# EAGLE design Adafruit Feather M0 Express dev (EAGLE 8.0.1)
COMPANY: ADAFRUIT INDUSTRIES; DRAWN: KTOWN; REV: B
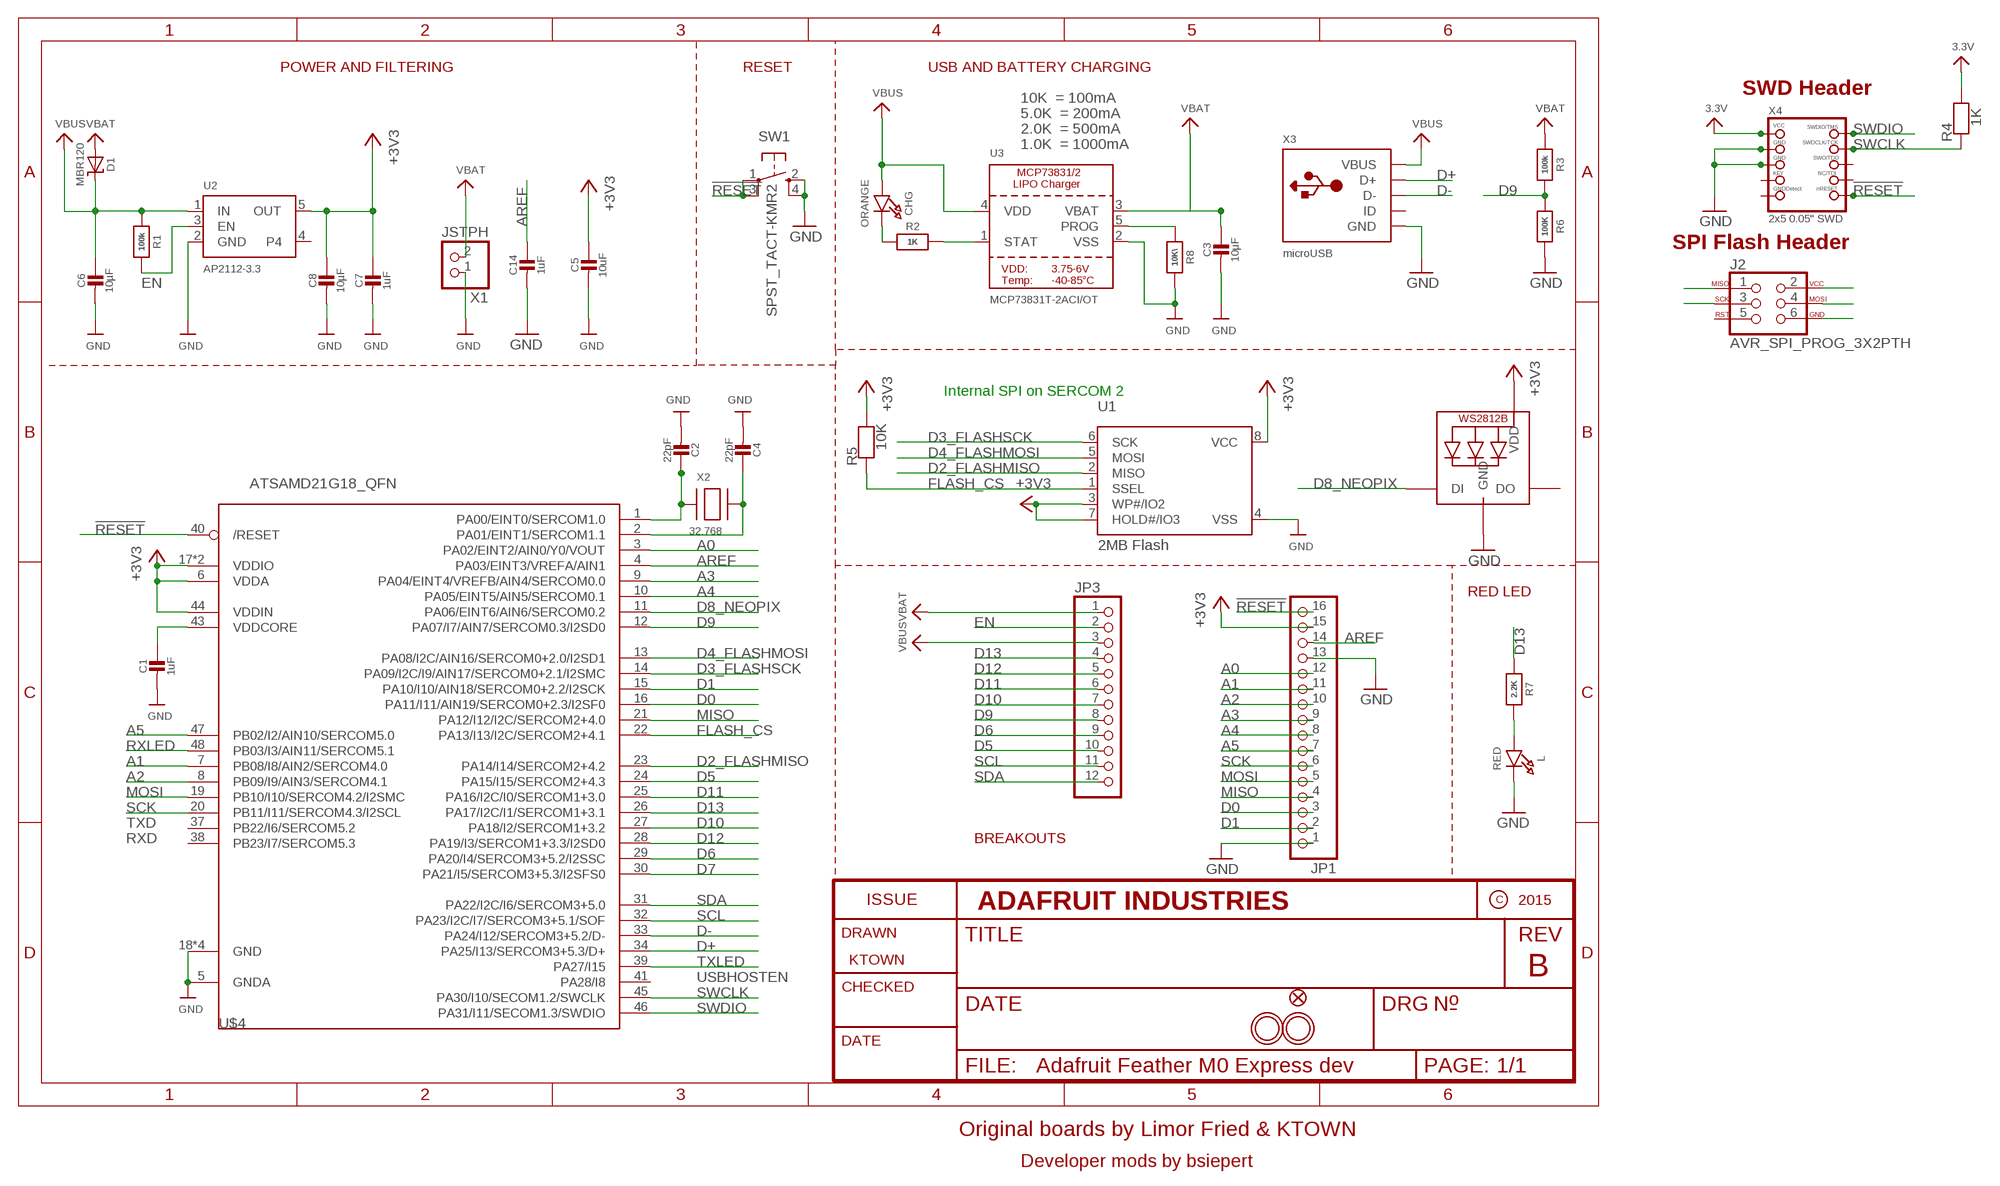
[diagram p0: schematic, sheet 1]

## Parts
C1  1uF  CAP_CERAMIC0603_NO  [0603-NO]
C2  22pF  CAP_CERAMIC0603_NO  [0603-NO]
C3  10µF  CAP_CERAMIC0805-NOOUTLINE  [0805-NO]
C4  22pF  CAP_CERAMIC0603_NO  [0603-NO]
C5  10uF  CAP_CERAMIC0805-NOOUTLINE  [0805-NO]
C6  10µF  CAP_CERAMIC0805-NOOUTLINE  [0805-NO]
C7  1uF  CAP_CERAMIC0603_NO  [0603-NO]
C8  10µF  CAP_CERAMIC0805-NOOUTLINE  [0805-NO]
C14  1uF  CAP_CERAMIC0603_NO  [0603-NO]
CHG  ORANGE  LED0805_NOOUTLINE  [CHIPLED_0805_NOOUTLINE]
D1  MBR120  DIODE-SCHOTTKYSOD-123  [SOD-123]
J2  AVR_SPI_PROG_3X2PTH  [2X3]
JP1  HEADER-1X16ROUND  [1X16_ROUND]
JP3  HEADER-1X12  [1X12_ROUND]
L  RED  LED0805_NOOUTLINE  [CHIPLED_0805_NOOUTLINE]
LED1  WS2812B3535  [LED3535]
R1  100k  RESISTOR_0603_NOOUT  [0603-NO]
R2  1K  RESISTOR_0603_NOOUT  [0603-NO]
R3  100k  RESISTOR_0603_NOOUT  [0603-NO]
R4  1K  RESISTOR0805_NOOUTLINE  [0805-NO]
R5  10K  RESISTOR_0603_NOOUT  [0603-NO]
R6  100K  RESISTOR_0603_NOOUT  [0603-NO]
R7  2.2K  RESISTOR_0603_NOOUT  [0603-NO]
R8  10K\  RESISTOR_0603_NOOUT  [0603-NO]
SW1  SPST_TACT-KMR2  [KMR2]
U1  2MB Flash  SPIFLASH_SOIC8208MIL  [SOIC8_208MIL]
U2  AP2112-3.3  VREG_SOT23-5  [SOT23-5]
U3  MCP73831T-2ACI/OT  MCP73831/2  [SOT23-5]
U$4  ATSAMD21G18_QFN  ATSAMD21G_QFN  [TQFN48_7MM]
U$31  MOUNTINGHOLE2.5  [MOUNTINGHOLE_2.5_PLATED]
U$32  MOUNTINGHOLE2.5  [MOUNTINGHOLE_2.5_PLATED]
U$34  FIDUCIAL""  [FIDUCIAL_1MM]
X1  JSTPH  CON_JST_PH_2PIN  [JSTPH2]
X2  32.768  XTAL-3.2X1.5  [XTAL3215]
X3  microUSB  USB_MICRO_20329_V2  [4UCONN_20329_V2]
X4  2x5 0.05" SWD  JTAG-CORTEXBOXPOSTS  [2X05_1.27MM_BOX_POSTS]

## Nets
!RESET: JP1.16 SW1.1(P) SW1.3(P1) U$4.40(/RESET) X4.10(NRESET)
+3V3: C5.1 C7.1 C8.1 J2.2 JP1.15 LED1.2(VDD) R4.2 R5.2 U1.3(WP#/IO2) U1.7(HOLD#/IO3) U1.8(VCC) U2.5(OUT) U$4.6(VDDA) U$4.17(VDDIO) U$4.36(VDDIO) U$4.44(VDDIN) X4.1(VCC) ; supply symbol labelled 3.3V
A0: JP1.12 U$4.3(PA02/EINT2/AIN0/Y0/VOUT)
A1: JP1.11 U$4.7(PB08/I8/AIN2/SERCOM4.0)
A2: JP1.10 U$4.8(PB09/I9/AIN3/SERCOM4.1)
A3: JP1.9 U$4.9(PA04/EINT4/VREFB/AIN4/SERCOM0.0)
A4: JP1.8 U$4.10(PA05/EINT5/AIN5/SERCOM0.1)
A5: JP1.7 U$4.47(PB02/I2/AIN10/SERCOM5.0)
AREF: C14.1 JP1.14 U$4.4(PA03/EINT3/VREFA/AIN1)
D0: JP1.3 U$4.16(PA11/I11/AIN19/SERCOM0+2.3/I2SF0)
D1: JP1.2 U$4.15(PA10/I10/AIN18/SERCOM0+2.2/I2SCK)
D2_FLASHMISO: J2.1 U1.2(MISO) U$4.23(PA14/I14/SERCOM2+4.2)
D3_FLASHSCK: J2.3 U1.6(SCK) U$4.14(PA09/I2C/I9/AIN17/SERCOM0+2.1/I2SMC)
D4_FLASHMOSI: J2.4 U1.5(MOSI) U$4.13(PA08/I2C/AIN16/SERCOM0+2.0/I2SD1)
D5: JP3.10 U$4.24(PA15/I15/SERCOM2+4.3)
D6: JP3.9 U$4.29(PA20/I4/SERCOM3+5.2/I2SSC)
D7: U$4.30(PA21/I5/SERCOM3+5.3/I2SFS0)
D8_NEOPIX: LED1.1(DI) U$4.11(PA06/EINT6/AIN6/SERCOM0.2)
D9: JP3.8 R3.2 R6.1 U$4.12(PA07/I7/AIN7/SERCOM0.3/I2SD0)
D10: JP3.7 U$4.27(PA18/I2/SERCOM1+3.2)
D11: JP3.6 U$4.25(PA16/I2C/I0/SERCOM1+3.0)
D12: JP3.5 U$4.28(PA19/I3/SERCOM1+3.3/I2SD0)
D13: JP3.4 R7.1 U$4.26(PA17/I2C/I1/SERCOM1+3.1)
D+: U$4.34(PA25/I13/SERCOM3+5.3/D+) X3.D+
D-: U$4.33(PA24/I12/SERCOM3+5.2/D-) X3.D-
EN: JP3.2 R1.2 U2.3(EN)
FLASH_CS: R5.1 U1.1(SSEL) U$4.22(PA13/I13/I2C/SERCOM2+4.1)
GND: C1.2 C2.2 C3.2 C4.2 C5.2 C6.2 C7.2 C8.2 C14.2 J2.6 JP1.1 JP1.13 L.C LED1.4(GND) R6.2 R8.2 SW1.2(S) SW1.4(S1) U1.4(VSS) U2.2(GND) U3.2(VSS) U$4.5(GNDA) U$4.18(GND) U$4.35(GND) U$4.42(GND) U$4.THERMAL(GND) X1.1 X3.BASE@1(GND) X3.BASE@2(GND) X3.GND X3.SPRT@1(GND) X3.SPRT@2(GND) X3.SPRT@3(GND) X3.SPRT@4(GND) X4.3(GND) X4.5(GND)
MISO: JP1.4 U$4.21(PA12/I12/I2C/SERCOM2+4.0)
MOSI: JP1.5 U$4.19(PB10/I10/SERCOM4.2/I2SMC)
N$1: CHG.C R2.1
N$2: L.A R7.2
N$3: R2.2 U3.1(STAT)
N$4: R8.1 U3.5(PROG)
N$5: C2.1 U$4.1(PA00/EINT0/SERCOM1.0) X2.P$1
N$7: C4.1 U$4.2(PA01/EINT1/SERCOM1.1) X2.P$2
RXLED: U$4.48(PB03/I3/AIN11/SERCOM5.1)
SCK: JP1.6 U$4.20(PB11/I11/SERCOM4.3/I2SCL)
SCL: JP3.11 U$4.32(PA23/I2C/I7/SERCOM3+5.1/SOF)
SDA: JP3.12 U$4.31(PA22/I2C/I6/SERCOM3+5.0)
SWCLK: R4.1 U$4.45(PA30/I10/SECOM1.2/SWCLK) X4.4(SWDCLK)
SWDIO: U$4.46(PA31/I11/SECOM1.3/SWDIO) X4.2(SWDIO)
TXLED: U$4.39(PA27/I15)
VBAT: C3.1 D1.A JP3.1 R3.1 U3.3(VBAT) X1.2
VBUS: C6.1 CHG.A D1.C JP3.3 R1.1 U2.1(IN) U3.4(VDD) X3.VBUS
VDDCORE: C1.1 U$4.43(VDDCORE)
Unconnected: J2.5 LED1.3(DO) U2.4 U$4.37(PB22/I6/SERCOM5.2) U$4.38(PB23/I7/SERCOM5.3) U$4.41(PA28/I8) X3.ID X4.6(SWO) X4.7(KEY) X4.8(TDI) X4.9(GNDDETECT)

## Notes on the sheet
- POWER AND FILTERING | RESET | USB AND BATTERY CHARGING
- SWD Header
- 10K  = 100mA
- 5.0K  = 200mA
- 2.0K  = 500mA
- 1.0K  = 1000mA
- SPI Flash Header
- Internal SPI on SERCOM 2
- RED LED
- TXD
- RXD | BREAKOUTS
- USBHOSTEN
- Original boards by Limor Fried & KTOWN
- Developer mods by bsiepert

## Library data of the parts
C1-C8 C14 = microbuilder:CAP_CERAMIC: Ceramic Capacitors For new designs, use the packages preceded by an '_' character since they are more reliable: The following footprints should be used on most boards: _0402 - Standard footprint for regular board layouts _0603 - Standard footprint for regular board layouts _0805 - Standard footprint for regular board layouts _1206 - Standard footprint for regular board layouts For extremely tight-pitch boards where space is at a premium, the following 'micro-pitch' footprints can be used (smaller pads, no silkscreen outline, etc.): _0402MP - Micro-pitch footprint for very dense/compact boards _0603MP - Micro-pitch footprint for very dense/compact boards _0805MP - Micro-pitch footprint for very dense/compact boards _1206MP - Micro-pitch footprint for very dense/compact boards
CHG L = microbuilder:LED: LED 0603 - 0603 Surface Mount Package 2mA: Green LED - Low Power (3.9mcd, 2ma, 1.7Vf) - Digikey: 475-2709-2-ND Orange LED - Low Power (9.8mcd, 2ma, 1.8Vf) - Digikey: 475-1194-2-ND Red LED - Low Power (5mcd, 2ma, 1.8Vf) - Digikey: 475-1195-2-ND Yellow LED - Low Power (7mcd, 2ma, 1.8Vf) - Digikey: 475-1196-2-ND 5mA: Blue LED - Low Power (17mcd, 5ma, 2.9Vf) - Digikey: LNJ937W8CRACT-ND 0805 - 0805 Surface Mount Package 2mA: Red LED (8.8mcd, 2mA, 1.8Vf, Clear) - Low Power [Digikey: 475-2510-1-ND] Green LED (5mcd, 2mA, 1.8Vf, Clear) - Low Power [Digikey: 475-2730-1-ND] Yellow LED (11.3mcd, 2mA, 1.8Vf, Clear) - Low Power [Digikey: 475-2555-1-ND] 20mA: Red LED (104mcd, 20mA, Diffused) - LS R976 [Digikey: 475-1278-6-ND] Red LED (12mcd, 20mA, 2.0Vf, Clear) - APT2012EC [Digikey: 754-1128-1-ND] Green LED (15mcd, 20mA, 2.2Vf, Clear) - APT2012GC [Digikey: 754-1131-1-ND] Orange LED (160mcd, 20mA, 2.1Vf, Clear) - APT2012SECK [Digikey: 754-1130-1-ND] 1206 - 1206 Surface Mount Package Green LED (26mcd, 20mA, Diffused) - LG N971 [Digikey: 475-1407-6-ND] Red LED (15mcd, 20mA, Diffused) - LH N974 [Digikey: 475-1416-6-ND] Cree - Cree High-Power Surface Mount LEDs XPEBWT-L1-0000-00D50 - White 111lm 350mA 2.9Vf 6200K 110° XTEAWT-00-0000-00000LEE3 - White 114lm 350mA 2.85Vf 5000K 115° Everlight - Everlight 45-21 Series Surface Mount LEDs 45-21/QK2C-B2832AC2CB2/2T - Warm White 2000mcd 20mA 3.25Vf 3050K 120° 45-21/LK2C-B38452C4CB2/2T - Nuetral White 2000mcd 20mA 3.25Vf 4150K 120° 45-21/LK2C-B50634C6CB2/2T - Cold White 2200mcd 20mA 3.25Vf 5650K 120° PLCC2 Reverse Mount LS T77K-J1L2-1-0-2-R18-Z - Red 11.25mcd 2mA 1.8Vf 630nm 120° LO T77K-L1M2-24-Z - Orange 19.6mcd 2mA 1.8Vf 606nm 120° LY T77K-K2M1-26-Z - Yellow 15.7mcd 2mA 1.8Vf 587nm 120°
D1 = microbuilder:DIODE-SCHOTTKY
J2 = SparkFun-Connectors:AVR_SPI_PROG_3X2: AVR ISP 6 Pin This is the reduced ISP connector for AVR programming. Common on Arduino. This footprint will take up less PCB space and can be used with a 10-pin to 6-pin adapter such as SKU: BOB-08508 **Special note about "TEST_POINT" package. The stop mask is on the top side, so if you want your programming test points to be on the bottom of your board, make sure to place this package on the bottom side of the board. This also ensure that the orientation to program from the bottom side will be correct. SparkFun Products: SparkFun ISP Pogo Adapter <https://www.sparkfun.com/products/11591> - NS Tiny AVR Programmer <https://www.sparkfun.com/products/11801> -PTH
JP1 = microbuilder:HEADER-1X16: PIN HEADER
JP3 = microbuilder:HEADER-1X12
LED1 = microbuilder:WS2812B
R1-R8 = microbuilder:RESISTOR: Resistors For new designs, use the packages preceded by an '_' character since they are more reliable: The following footprints should be used on most boards: _0402 - Standard footprint for regular board layouts _0603 - Standard footprint for regular board layouts _0805 - Standard footprint for regular board layouts _1206 - Standard footprint for regular board layouts For extremely tight-pitch boards where space is at a premium, the following 'micro-pitch' footprints can be used (smaller pads, no silkscreen outline, etc.): _0402MP - Micro-pitch footprint for very dense/compact boards _0603MP - Micro-pitch footprint for very dense/compact boards _0805MP - Micro-pitch footprint for very dense/compact boards _1206MP - Micro-pitch footprint for very dense/compact boards
SW1 = adafruit:SPST_TACT: SMT 6mm switch, EVQQ2 series http://www.ladyada.net/library/eagle
U1 = microbuilder:SPIFLASH_SOIC8: SOIC8 SPI Flash Be careful with the size since SOIC8 flash comes in several 'widths' SOIC8 150 mil M25P16 - 16Mbit (2Mbit x 8) Serial Flash (75MHz SPI Bus), Supply: 2.7-3.6V Digikey: SOIC8 - M25P16-VMN6P-ND SOIC8 208 mil W25Q16BVSSIG - 16Mbit (2Mbit x 8) Serial Flash (104MHz SPI Bus), Supply: 2.7-3.6V Digikey: SOIC8 - W25Q16BVSSIG-ND
U2 = microbuilder:VREG_SOT23-5: SOT23-5 Fixed Voltage Regulators Part Current Out V Out V In V Dropout θJA (°C/W) TJ (°C) Digikey Part No. ADP121 150mA 3.3V 3.4-5.5V 0.09V @ 150mA -- -- ADP121-AUJZ33R7CT-ND ADP121 150mA 3.0V 3.1-5.5V 0.09V @ 150mA -- -- ADP121-AUJZ30R7CT-ND ADP122 300mA 3.3V 3.4-5.5V 0.085V @ 300mA -- -- ADP122AUJZ-3.3-R7CT-ND ADP1712 300mA 3.3V 3.5-5.5V 0.17V @ 300mA -- -- ADP1712AUJZ-3.3-R7TR-ND AP7311 (Low Cost) 150mA 3.3V 3.5-6V 0.15V @ 150mA -- -- AP7311-33WG-7DICT-ND LD39015M18R 150mA 1.8V 1.9V-5.5V 0.08V @ 100mA -- -- 497-6977-1-ND LP2985A-33DBVR 150mA 3.3V 3.3-16V 0.28V @ 150mA 206 150 296-18479-1-ND MCP1824T-3302E/OT 300mA 3.3V 3.5V-6V 0.2V @ 300mA -- -- MCP1824T-3302E/OTCT-ND MIC5205-2.5YM5 TR 150mA 2.5V 2.7-16V 0.165V @ 150mA -- -- 576-1257-2-ND MIC5205-3.0YM5 TR 150mA 3.0V 3.2V-16V 0.165V @ 150mA -- -- 576-1258-2-ND MIC5205-3.3YM5 TR 150mA 3.3V 3.5V-16V 0.165V @ 150mA -- -- 576-1259-2-ND TPS780330220 150mA 3.3V+2.2V 3.6-5.5V 250mV Max -- -- 296-23332-1-ND TDA3663/N1,135 100mA 3.3V 3.5-45V 0.18V @ 50mA -- -- 568-5343-1-ND Max operating temp can be calculated using θJA, TJ (max junction temperature), and power in watts. Set the "Maximum Ambient Temperature" until it reaches TJ ("Max Junction Temperature"), which is the absolute limit for safe use of the regulator: Heat Sink Temperature Calculator <http://www.daycounter.com/Calculators/Heat-Sink-Temperature-Calculator.phtml> For example, With 12V source into a 3.3V LP2985 and a 30mA load, we are dissipating (12V-3.3V) * 0.03A = 0.261W. With a θJA of 206 °C/W, a TJ of 150°C, and 261mW we can safely use the chip without a heat sink up to 75°C (=147.1°C Junction Temperature).
U3 = microbuilder:MCP73831/2: MCP73831/2 LIPO Charger VDD: 3.75 - 6V Temp -40 - 85°C Programmable Charge Rate: 15-500mA NOTE: STAT is a tri-state logic output on the MCP73831 and an open-drain output on the MCP73832. SOT23-5 with 4.2V output and tri-state logic on STAT = MCP73831T-2ACI/OT
U$4 = microbuilder:ATSAMD21G
U$31 U$32 = microbuilder:MOUNTINGHOLE: Mounting Hole For #2 screws (0.086"/2.18mm width, 0.094"/2.4mm hole) use 2.5mm; BOM: EXCLUDE
U$34 = microbuilder:FIDUCIAL: Fiducial Alignment Points Various fiducial points for machine vision alignment.; BOM: EXCLUDE
X1 = microbuilder:CON_JST_PH_2PIN: JST 2-Pin Right-Angle Connector PH-Series - 4UConnector: 17311 SH-Series - 4UConnector: 07278
X2 = adafruit2:XTAL: Low cost SMT crystals, no capacitors included http://www.ladyada.net/library/eagle
X3 = microbuilder:USB: USB Connectors USBMINIB - Surface Mount Female Mini-B USB Connector 4UConnector: 06564
X4 = microbuilder:JTAG-CORTEX: Serial Wire (SW-DP) Connector Standard 0.05" 10-pin connector is for use with the Cortex M and Cortex A SWD (serial wire debugger) interface (SW-DP) Connectors 2x05_1.27MM_SMT - Inexpensive surface-mount header with bare pins, compatible with standard 10-pin SWD cables (4UCON: 16846) 2x05_1.27MM_BOX_NOPOSTS - Polarised surface-mount box (4UCON with caps: 19735, without caps: 15117 2x05_1.27MM_BOX_POSTS - Polarised surface-mount box with mounting holes (4UCON: 20317) Pinout: http://infocenter.arm.com/help/topic/com.arm.doc.faqs/attached/13634/cortex_debug_connectors.pdf http://www.keil.com/peripherals/coresight/connectors.asp

## Board
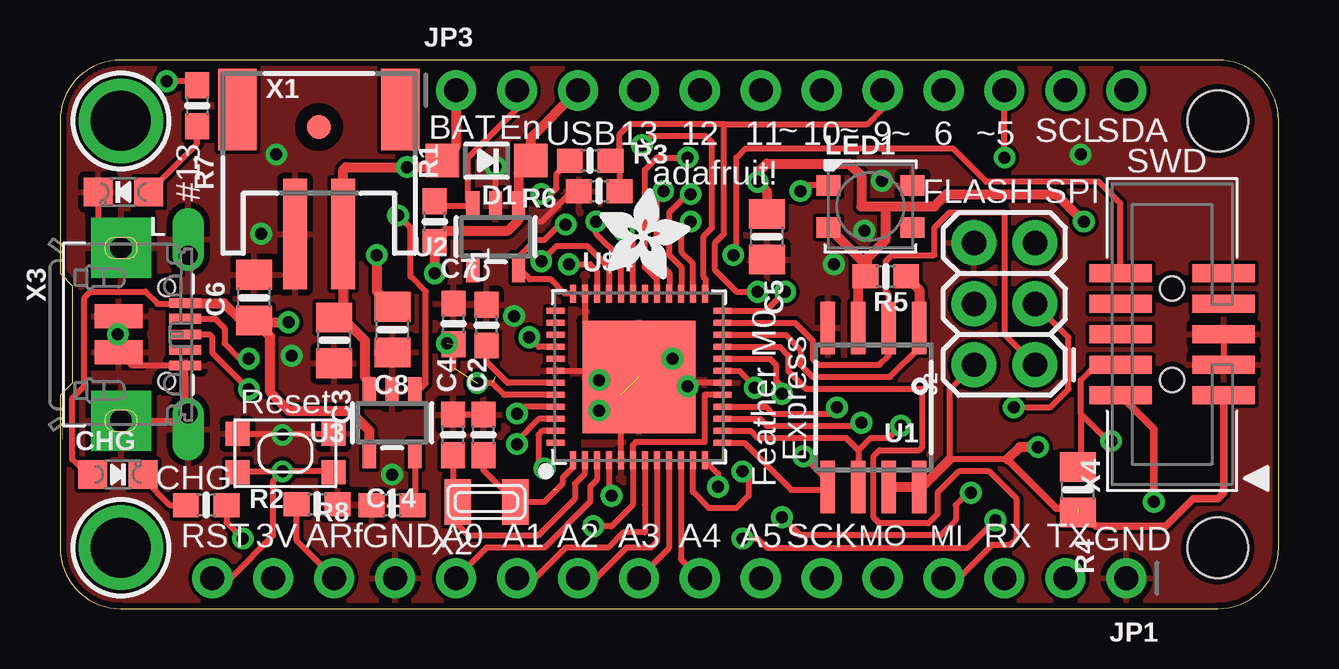
[diagram p1: board, top side]
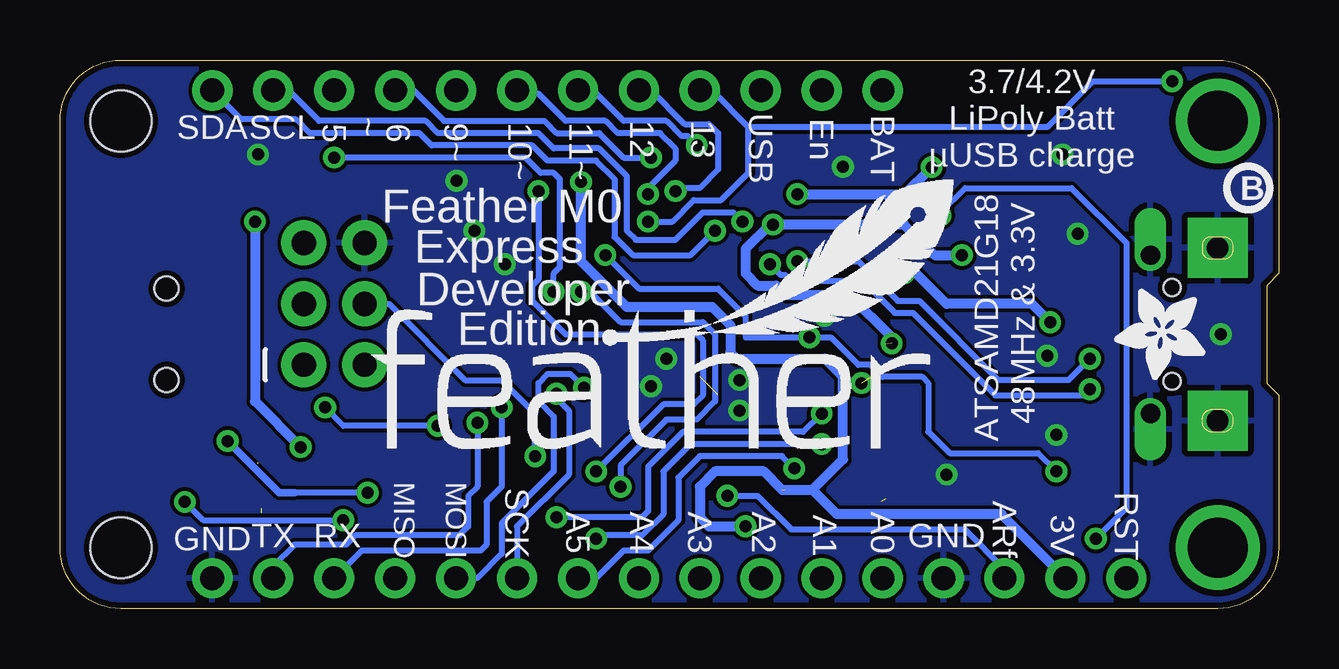
[diagram p2: board, bottom side, seen from below]

Size 50.8 x 22.86 mm. Coordinates in mm from the lower left corner, seen from the top.
Outline: 2.54,0 48.26,0 arc90 50.8,2.54 50.8,20.32 arc90 48.26,22.86 2.54,22.86 arc90 0,20.32 0,13.97 0.51,13.46 0.51,9.4 0,8.89 0,2.54 arc90 2.54,0
Copper layers (1*16): Top 0.035mm / dielectric 1.5mm / Bottom 0.035mm
Design rules "adafruit *": minimum track width 6mil, minimum drill 10mil, track to track 6mil, track to pad 6mil, pad to pad 6mil, via to via 6mil, smd to smd 6mil, copper to edge 10mil, drill to drill 8mil, minimum pad ring 10mil, minimum via ring 8mil, stop-mask expansion 2mil, vias tented up to drill 20mil, thermal gap 10mil
Holes 2.54 mm at 48.26,20.32 48.26,2.54
tRestrict: area 21.3,6.9 to 21.7,9.7; area 22.1,12.1 to 27.1,12.4; area 26.5,9.7 to 27.1,12.2

### Footprints (pad centres in the part's own frame; a part is rotated, then mirrored left to right if it is on the bottom)
0603-NO = smd 1.075 x 1: 1 -0.85,0; 2 0.85,0
0805-NO = smd 1.24 x 1.5: 1 -0.95,0; 2 0.95,0
CHIPLED_0805_NOOUTLINE = smd 1.2 x 1.2: A 0,-1.05; C 0,1.05
SOD-123 = smd 1.4 x 1.4: A 1.85,0; C -1.85,0
2X3 = drill 1.016 pad 1.88: 1 0,0; 2 0,2.54; 3 2.54,0; 4 2.54,2.54; 5 5.08,0; 6 5.08,2.54
1X16_ROUND = drill 1 pad 1.676: 1 -19.05,0; 2 -16.51,0; 3 -13.97,0; 4 -11.43,0; 5 -8.89,0; 6 -6.35,0; 7 -3.81,0; 8 -1.27,0; 9 1.27,0; 10 3.81,0; 11 6.35,0; 12 8.89,0; 13 11.43,0; 14 13.97,0; 15 16.51,0; 16 19.05,0
1X12_ROUND = drill 1 pad 1.676: 1 -13.97,0; 2 -11.43,0; 3 -8.89,0; 4 -6.35,0; 5 -3.81,0; 6 -1.27,0; 7 1.27,0; 8 3.81,0; 9 6.35,0; 10 8.89,0; 11 11.43,0; 12 13.97,0
LED3535 = smd 1 x 0.85: 1 -1.75,0.875; 2 -1.75,-0.875; 3 1.75,-0.875; 4 1.75,0.875
KMR2 = smd 1 x 1: 1 2,0.8; 2 2,-0.8; 3 -2,0.8; 4 -2,-0.8
SOIC8_208MIL = smd 0.6 x 2.2: 1 -1.905,-3.315; 2 -0.635,-3.315; 3 0.635,-3.315; 4 1.905,-3.315; 5 1.905,3.315; 6 0.635,3.315; 7 -0.635,3.315; 8 -1.905,3.315
SOT23-5 = smd 0.55 x 1.2: 1 -0.95,-1.3; 2 0,-1.3; 3 0.95,-1.3; 4 0.95,1.3; 5 -0.95,1.3
TQFN48_7MM = smd 0.25 x 0.75: 1 -2.75,-3.475; 2 -2.25,-3.475; 3 -1.75,-3.475; 4 -1.25,-3.475; 5 -0.75,-3.475; 6 -0.25,-3.475; 7 0.25,-3.475; 8 0.75,-3.475; 9 1.25,-3.475; 10 1.75,-3.475; 11 2.25,-3.475; 12 2.75,-3.475; 25 2.75,3.475; 26 2.25,3.475; 27 1.75,3.475; 28 1.25,3.475; 29 0.75,3.475; 30 0.25,3.475; 31 -0.25,3.475; 32 -0.75,3.475; 33 -1.25,3.475; 34 -1.75,3.475; 35 -2.25,3.475; 36 -2.75,3.475 | smd 0.75 x 0.25: 13 3.475,-2.75; 14 3.475,-2.25; 15 3.475,-1.75; 16 3.475,-1.25; 17 3.475,-0.75; 18 3.475,-0.25; 19 3.475,0.25; 20 3.475,0.75; 21 3.475,1.25; 22 3.475,1.75; 23 3.475,2.25; 24 3.475,2.75; 37 -3.475,2.75; 38 -3.475,2.25; 39 -3.475,1.75; 40 -3.475,1.25; 41 -3.475,0.75; 42 -3.475,0.25; 43 -3.475,-0.25; 44 -3.475,-0.75; 45 -3.475,-1.25; 46 -3.475,-1.75; 47 -3.475,-2.25; 48 -3.475,-2.75 | smd 4.7 x 4.7: THERMAL 0,0
MOUNTINGHOLE_2.5_PLATED = drill 2.5 pad 3.2: P$1 0,0
FIDUCIAL_1MM = smd 1 x 1: 1 0,0
JSTPH2 = smd 1 x 4.6: 1 -1,-3.7; 2 1,-3.7 | smd 1.6 x 3.4: NC1 -3.4,1.5; NC2 3.4,1.5
XTAL3215 = smd 1.1 x 1.9: P$1 1.2,0; P$2 -1.2,0
4UCONN_20329_V2 = smd 1 x 2: BASE@1 -0.75,-2; BASE@2 0.75,-2 | smd 0.4 x 1.35: D+ 0,0.775; D- -0.65,0.775; GND 1.3,0.775; ID 0.65,0.775; VBUS -1.3,0.775 | drill 0.8 pad 1.2 offset: SPRT@1 -3.3,0.9; SPRT@2 3.3,0.9 | drill 0.9 pad 2.5 square: SPRT@3 -3.6,-1.9; SPRT@4 3.6,-1.9 | hole 0.7: -1.95,0; 1.95,0
2X05_1.27MM_BOX_POSTS = smd 0.76 x 2.6: 1 -2.54,-2.15; 2 -2.54,2.15; 3 -1.27,-2.15; 4 -1.27,2.15; 5 0,-2.15; 6 0,2.15; 7 1.27,-2.15; 8 1.27,2.15; 9 2.54,-2.15; 10 2.54,2.15 | hole 1: -1.905,0; 1.905,0

### Placement (x,y rotation side)
C1  17.78,11.81 90 top
C2  17.65,7.24 90 top
C3  11.43,11.18 270 top
C4  16.38,7.24 90 top
C5  29.46,15.49 270 top
C6  8.09,12.96 90 top
C7  16.4,11.86 90 top
C8  13.86,11.62 270 top
C14  10.72,4.34 0 top
CHG  2.41,5.59 270 top
D1  17.78,18.67 180 top
J2  40.64,10.16 90 top
JP1  25.4,1.27 180 top
JP3  30.48,21.59 0 top
L  2.65,17.36 90 top
LED1  33.78,16.76 0 top
R1  15.62,16.13 90 top
R2  6.1,4.32 0 top
R3  22.1,18.67 0 top
R4  42.42,4.95 270 top
R5  34.42,13.84 180 top
R6  22.48,17.4 180 top
R7  5.71,20.95 270 top
R8  13.84,4.32 180 top
SW1  9.4,6.48 180 top
U1  33.91,8.38 180 top
U2  18.16,15.49 180 top
U3  13.84,7.75 180 top
U$4  24.13,9.65 0 top
U$7  [ADAFRUIT_3.5MM]  22.48,13.72 0 top
U$9  [FEATHERLOGO]  37.85,6.6 0 bottom
U$12  [ADAFRUIT_3.5MM]  3.05,13.34 180 bottom
U$13  [PCBFEAT-REV-040]  1.27,17.53 0 bottom
U$31  2.54,20.32 270 top
U$32  2.54,2.54 270 top
U$34  10.79,20.07 270 top
X1  10.79,19.3 0 top
X2  17.78,4.45 0 top
X3  4.45,11.43 270 top
X4  46.35,11.43 90 top

### Tracks (layer width: path | path; a pad name or v marks a point on that pad's centre or on a via)
!RESET  (via drill 0.5)
  Top 0.254: 6.48,1.27 JP1.16 7.11,1.27 8.89,3.05 8.89,5.33 v9.27,5.71 | U$4.40 19.96,10.9 v19.56,11.3 | SW1.1 7.44,5.71 v9.27,5.71 | SW1.3 11.36,5.71 v9.27,5.71 | v28.07,14.73 28.19,14.86 28.19,18.8 28.57,19.18 37.21,19.18 38.61,17.78 43.31,17.78 44.2,16.88 X4.10
  Bottom 0.254: v9.27,5.71 10.03,6.48 13.72,6.48 14.61,7.37 14.61,9.4 14.86,9.65 16.51,9.65 17.02,10.16 17.53,10.16 18.67,11.3 v19.56,11.3 22.23,11.3 22.23,12.19 23.37,13.34 26.67,13.34 v28.07,14.73
+3V3  (via drill 0.5)  (5 unrouted)
  Top 0.254: v22.23,3.43 22.99,3.43 23.88,4.32 U$4.6 23.88,6.81 24,6.93 26.87,6.93 26.87,8.9 U$4.17 | 16.4,10.04 C7.1 | v21.08,16 20.83,16 20.19,15.37 19.81,15.37 19.11,14.67 U2.5 19.59,13.72 20.45,13.72 21.04,13.13 U$4.36 | 39.5,6.22 37.08,6.22 37.08,9.14 J2.2 | U$4.44 18.53,8.9 18.03,9.4 v17.4,9.4
  Top 0.305: X4.1 48.51,8.88 48.51,4.83 48.26,4.57 47.24,4.57 46.1,3.43 43.18,3.43 42.42,4.19 41.53,4.19 39.5,6.22
  Top 0.406: v13.21,14.73 13.21,13.22 C8.1 | 16.38,10.99 C7.1 | 37.08,6.22 35.93,5.07 U1.8 U1.7 | LED1.2 33.66,14.27 | 34.54,16.76 33.4,16.76 33.4,18.03 32.89,18.54 29.46,18.54 29.08,18.16 v29.08,17.78 29.46,17.4 C5.1 | 34.54,16.76 36.45,16.76 36.96,17.27 41.53,17.27 v42.67,16.13 | 33.66,14.27 33.66,14.61 34.42,15.37 34.42,16.64 34.54,16.76 | U1.3 33.27,13.55 R5.2 33.57,14.18 33.66,14.27 | v40.77,6.73 40.01,6.73 39.5,6.22
  Bottom 0.254: 21.21,16 v21.08,16
  Bottom 0.406: v22.23,3.43 23.75,3.43 24.13,3.81 24.13,5.08 23.5,5.71 21.46,5.71 20.7,4.95 | 21.21,16 22.23,14.99 22.23,13.97 21.72,13.46 20.95,13.46 20.57,13.08 17.91,13.08 16.13,11.3 v16.13,11.05 | v13.21,14.73 14.35,14.73 15.62,16 v21.08,16 | v29.08,17.78 29.08,14.48 27.18,12.57 23.62,12.57 22.86,11.81 22.86,10.67 22.61,10.41 18.92,10.41 18.16,9.65 18.16,6.22 19.43,4.95 | 20.57,4.95 19.43,4.95 | JP1.15 11.56,3.94 18.41,3.94 19.43,4.95 | v42.67,16.13 42.67,8.64 v40.77,6.73
A0
  Top 0.254: U$4.3 22.38,5.36 22.1,5.08 22.1,4.45 20.19,2.54 17.78,2.54 JP1.12
A1
  Top 0.254: U$4.7 24.38,4.31 24.38,3.17 23.5,3.17 22.86,2.54 21.08,2.54 19.81,1.27 JP1.11
A2
  Top 0.254: U$4.8 24.88,2.78 24.64,2.54 23.62,2.54 22.35,1.27 JP1.10 21.84,1.27
A3
  Top 0.254: U$4.9 25.38,2.52 JP1.9
A4
  Top 0.254: U$4.10 25.88,2.06 JP1.8
A5  (via drill 0.5)
  Top 0.254: U$4.47 20.1,7.4 19.94,7.24 19.94,6.1 v20.19,5.84
  Bottom 0.254: v20.19,5.84 20.7,6.35 24.13,6.35 25.02,5.46 25.02,3.68 26.29,2.41 27.3,2.41 28.45,1.27 JP1.7
AREF  (via drill 0.5)
  Top 0.254: JP1.14 9.87,2.83 C14.1 | U$4.4 22.88,4.81 v22.99,4.7
  Bottom 0.254: 11.43,1.78 JP1.14 11.43,1.65 13.08,3.3 20.32,3.3 21.72,4.7 v22.99,4.7
D0  (via drill 0.5)
  Top 0.254: U$4.16 29.44,8.4 29.72,8.13 32.13,8.13 v32.38,8.38
  Bottom 0.254: v32.38,8.38 32.38,5.08 33.02,4.45 33.02,2.67 33.27,2.41 38.23,2.41 JP1.3
D1  (via drill 0.5)
  Top 0.254: U$4.15 29.18,7.9 29.46,7.62 33.27,7.62 v33.4,7.75
  Bottom 0.254: JP1.2 41.91,1.78 41.02,2.67 38.86,2.67 38.48,3.05 34.16,3.05 33.78,3.43 33.78,4.7 33.4,5.08 v33.4,7.75
D2_FLASHMISO
  Top 0.254: U$4.23 30.64,11.9 31.37,11.18 31.37,10.41 31.62,10.16 34.16,10.16 34.54,10.54 U1.2 34.54,13.08 34.42,13.21 34.42,14.48 34.67,14.73 36.45,14.73 36.45,15.88 37.08,16.51 39.37,16.51 39.37,11.43 J2.1
D3_FLASHSCK  (via drill 0.5)
  Top 0.254: U$4.14 28.79,7.4 29.08,7.11 32.77,7.11 33.27,6.6 | 33.27,6.6 U1.6 | 33.27,6.6 33.78,7.11 34.54,7.11 v35.05,7.62 | v39.75,8.38 41.27,8.38 42.04,9.14 42.04,11.3 J2.3
  Bottom 0.254: v35.05,7.62 38.99,7.62 v39.75,8.38
D4_FLASHMOSI  (via drill 0.5)
  Top 0.254: U$4.13 28.53,6.9 30.48,4.95 31.89,4.95 U1.5 32,5.33 v30.99,6.35
  Bottom 0.254: v30.99,6.35 30.99,8.13 32.38,9.53 33.91,9.53 37.08,12.7 J2.4
D5  (via drill 0.5)
  Top 0.254: U$4.24 29.42,12.4 v30.23,13.21 | v39.37,18.8 JP3.10
  Bottom 0.254: v30.23,13.21 30.23,13.97 29.97,14.22 29.97,17.91 30.23,18.16 30.76,18.16 31.39,18.8 v39.37,18.8
D6  (via drill 0.5)
  Top 0.254: U$4.29 24.88,13.73 24.38,14.22 24.38,18.29 24.89,18.8 v26.16,18.8
  Bottom 0.254: JP3.9 36.07,21.59 34.8,20.32 30.61,20.32 30.1,19.81 28.32,19.81 27.3,18.8 v26.16,18.8
D8_NEOPIX  (via drill 0.5)
  Top 0.254: LED1.1 31.1,17.64 v30.86,17.4 | v28.45,5.71 28.7,5.46 28.7,4.7 28.19,4.19 27.05,4.19 26.38,4.86 U$4.11
  Bottom 0.254: v30.86,17.4 30.86,13.72 31.11,13.46 31.11,12.83 29.72,11.43 24.26,11.43 24,11.18 24,8.89 24.38,8.51 25.65,8.51 v28.45,5.71
D9  (via drill 0.5)
  Top 0.254: JP3.8 34.29,20.83 33.66,20.19 27.69,20.19 | R3.2 23.33,18.67 | 23.33,18.67 R6.1 | 23.33,18.67 23.33,19.77 23.75,20.19 27.69,20.19 | U$4.12 27.43,5.62 v27.43,5.08 | 28.83,13.21 v29.08,13.21 28.19,13.21 27.3,14.1 27.3,15.24 27.69,15.62 27.69,20.19
  Bottom 0.254: 28.83,13.21 v29.08,13.21 28.7,13.21 27.43,11.94 24,11.94 23.5,11.43 23.5,8.64 24.26,7.87 25.53,7.87 27.43,5.97 v27.43,5.08
D10  (via drill 0.5)
  Top 0.254: U$4.27 25.91,13.15 25.91,14.22 25.4,14.73 25.4,16.51 26.16,17.27 v26.29,17.27
  Bottom 0.254: JP3.7 31.62,21.46 30.86,21.46 29.72,20.32 28.07,20.32 27.56,19.81 25.78,19.81 25.15,19.18 25.15,18.67 26.29,17.53 v26.29,17.27
D11  (via drill 0.5)
  Top 0.254: v24.26,19.3 24.64,19.68 26.92,19.68 27.18,19.43 27.18,15.88 26.83,15.53 26.83,13.81 26.92,13.72 26.92,13.34 | 26.92,13.34 26.92,13.17 U$4.25 26.88,13.29 26.92,13.34
  Bottom 0.254: v24.26,19.3 24.64,19.68 24.89,19.68 25.53,20.32 27.3,20.32 28.57,21.59 JP3.6
D12  (via drill 0.5)
  Top 0.254: U$4.28 25.4,13.15 25.4,13.97 24.87,14.5 24.87,17.16 24.91,17.16 v25.15,17.4
  Bottom 0.254: JP3.5 26.16,21.59 24.77,20.19 23.75,20.19 23.37,19.81 23.37,18.29 24.13,17.53 25.02,17.53 v25.15,17.4
D13  (via drill 0.5)
  Top 0.254: R7.1 5.55,21.97 v4.45,21.97 | U$4.26 26.38,14.39 25.91,14.86 25.91,15.75 v26.29,16.13
  Bottom 0.254: 22.1,20.07 9.65,20.07 7.75,21.97 v4.45,21.97 | v26.29,16.13 25.27,16.13 24.38,17.02 23.24,17.02 22.1,18.16 22.1,20.07 | 22.1,20.07 23.62,21.59 JP3.4
D+  (via drill 0.5)
  Top 0.254: X3.D+ 6.22,11.43 6.35,11.3 6.35,10.67 v7.87,9.14 | v21.21,14.35 22.1,14.35 22.38,14.07 U$4.34
  Bottom 0.254: v7.87,9.14 8.13,8.89 11.75,8.89 11.81,8.89 15.24,12.32 16,12.32 17.34,13.65 20.32,13.65 20.57,13.91 20.77,13.91 v21.21,14.35
D-  (via drill 0.5)
  Top 0.254: X3.D- 6.46,12.08 6.86,11.68 6.86,11.05 7.49,10.41 v7.87,10.41 | v20.07,14.48 20.7,15.11 21.97,15.11 22.88,14.2 U$4.33
  Bottom 0.254: v7.87,10.41 8.76,9.53 11.68,9.53 14.99,12.83 15.88,12.83 17.53,14.48 v20.07,14.48
EN
  Top 0.254: JP3.2 19.05,20.83 17.02,18.8 17.02,16.99 U2.3 15.81,16.79 R1.2
FLASH_CS
  Top 0.254: U$4.22 30.25,11.4 30.86,10.79 30.86,10.16 31.37,9.65 34.6,9.65 35.81,10.86 U1.1
  Top 0.406: U1.1 35.81,13.3 R5.1
GND  (via drill 0.5)  (1 unrouted)
  Top 0.254: L.C 1.59,15.03 X3.SPRT@3 | X3.BASE@2 3,10.13 X3.GND 5.22,8.26 X3.SPRT@2 5.04,7.83 X3.SPRT@4 | SW1.2 SW1.4 11.52,7.28 | 13.97,10.67 C8.2 | U$4.35 21.88,11.9 U$4.THERMAL 23.88,9.9 U$4.42 | U$4.5 23.38,8.9 | C2.2 C4.2 | U2.2 18.16,18.03 | R6.2 21.34,17.4 20.07,16.13 19.94,16.13 | X4.5 X4.3 | U$4.18 26.29,9.4 v26.16,9.27
  other vias: 2.41,11.43 9.65,10.54 9.02,18.92 13.84,5.59 9.27,7.24 18.92,12.19 18.16,18.41 22.48,9.53 25.53,10.41 22.48,8.26 33.53,15.75 8.38,15.62 32.26,14.35 34.26,17.83 42.55,18.92
  pour Top: 0,22.86 0,0 51.18,0 50.67,22.86
  pour Bottom: 51.18,0 0,0 0,22.86 50.67,22.86
MISO
  Top 0.254: U$4.21 30.02,10.9 30.35,10.57 30.35,9.91 31.11,9.14 35.94,9.14 35.94,6.73 35.81,6.6 34.16,6.6 33.91,6.35 33.91,3.81 34.16,3.56 36.2,3.56 36.58,3.94 36.58,4.83 37.47,5.71 38.73,5.71 39.88,4.57 39.88,2.92 39.62,2.67 38.86,2.67 37.47,1.27 JP1.4
MOSI  (via drill 0.5)
  Top 0.254: U$4.19 28.32,9.9 28.96,9.27 v28.96,9.21
  Bottom 0.254: v28.96,9.21 29.53,9.78 30.48,9.78 30.86,9.4 30.86,8.64 30.23,8 30.23,5.71 32.38,3.56 32.38,2.29 33.4,1.27 JP1.5
N$1
  Top 0.254: CHG.C 3.46,5.43 4.57,4.32 R2.1
N$2
  Top 0.254: L.A 5.71,19.38 R7.2
N$3  (via drill 0.5)
  Top 0.254: U3.1 14.89,9.05 15.24,9.4 15.24,13.21 14.61,13.84 14.61,15.88 v14.1,16.38 | R2.2 6.95,3.6 v7.62,2.92
  Bottom 0.254: v7.62,2.92 6.35,4.19 6.35,15.24 8.64,17.53 13.08,17.53 14.1,16.51 v14.1,16.38
N$4
  Top 0.254: U3.5 14.79,4.42 R8.1
N$5
  Top 0.254: U$4.1 21.38,5.89 20.95,5.46 20.95,5.21 20.19,4.45 X2.P$1 17.65,5.77 C2.1
N$7  (1 unrouted)
  Top 0.254: U$4.2 21.88,5.62 21.46,5.21 21.46,4.57 19.94,3.05 17.02,3.05 16.58,3.49 X2.P$2 | C4.1 16.38,4.57
SCK  (via drill 0.5)
  Top 0.254: U$4.20 29.6,10.4 29.84,10.16 29.84,9.53 30.1,9.27 v30.1,8.95
  Bottom 0.254: v30.1,8.95 30.1,8.76 29.59,8.26 29.59,5.59 31.75,3.43 JP1.6
SCL  (via drill 0.5)
  Top 0.254: U$4.32 23.38,14.59 22.35,15.62 v22.35,16.13 22.35,16
  Bottom 0.254: JP3.11 41.27,21.59 40.01,20.32 35.56,20.32 35.05,19.81 30.86,19.81 30.23,19.18 28.32,19.18 27.18,18.03 27.18,15.75 26.8,15.37 25.15,15.37 24,16.51 22.73,16.51 v22.35,16.13
SDA  (via drill 0.5)
  Top 0.254: U$4.31 23.88,15.36 v23.5,15.75
  Bottom 0.254: JP3.12 43.24,20.38 40.96,20.38 40.39,19.81 35.81,19.81 35.31,19.3 31.11,19.3 30.48,18.67 28.45,18.67 27.69,17.91 27.69,15.49 26.92,14.73 24.51,14.73 v23.5,15.75
SWCLK  (via drill 0.5)  (1 unrouted)
  Top 0.254: U$4.45 19.32,8.4 v19.05,8.13 | v30.1,3.81 30.86,3.05 36.7,3.05 37.34,3.68 37.34,4.32 37.85,4.83 v37.97,4.83 | X4.4 43.18,10.16 42.55,9.53 42.55,8.13 | 42.55,6.1 42.61,6.1 | v43.81,6.99 43.69,6.99 42.55,8.13 | 42.55,8.13 42.55,6.03 R4.1
  Top 0.305: R4.1 42.55,6.03 | 43.5,6.99 v43.81,6.99
  Bottom 0.254: v30.1,3.81 26.54,3.81 26.29,4.06 26.29,5.92 24.85,7.36 24.85,7.37 19.81,7.37 v19.05,8.13 | v37.97,4.83 41.02,4.83
  Bottom 0.305: 41.02,4.83 41.66,4.83 v43.81,6.99
SWDIO  (via drill 0.5)
  Top 0.254: v28.45,2.92 29.08,2.92 29.46,2.54 37.85,2.54 v38.99,3.68 | v19.05,6.86 19.05,6.99 19.97,7.9 U$4.46
  Top 0.305: v45.59,4.45 45.59,7.5 X4.2
  Bottom 0.254: v19.05,6.86 24.51,6.86 25.65,5.71 25.65,3.94 26.54,3.05 28.32,3.05 v28.45,2.92 | v45.59,4.45 44.83,3.68 v38.99,3.68
VBAT  (via drill 0.5)
  Top 0.254: X1.2 11.81,15.62 | R3.1 20.7,18.12 20.7,17.53 20.45,17.27 v20.07,17.27 | 11.79,12.49 C3.1
  Top 0.406: 11.81,15.62 11.81,18.29 11.92,18.4 v14.46,18.4 15.66,18.4 D1.A 16.51,19.25 JP3.1 | X1.2 11.79,12.49 | C3.1 11.75,12.13 12.7,11.18 12.7,9.65 12.89,9.46 U3.3
  Bottom 0.406: v20.07,17.27 15.59,17.27 v14.46,18.4
VBUS  (via drill 0.5)
  Top 0.254: CHG.A 1.14,5.59 0.51,6.22 0.51,8.76 1.02,9.27 1.02,12.95 1.27,13.21 3.56,13.21 4.06,12.7 5.19,12.7 X3.VBUS | 7.55,12.01 C6.1 8.16,11.94
  Top 0.406: X3.VBUS 6.83,12.73 7.55,12.01 | JP3.3 19.63,19.63 D1.C 19.11,18.15 U2.1 19.11,16.19 18.67,15.75 16.09,15.75 R1.1 v15.62,13.97 | U3.4 12.89,7.43 12.06,8.26 9.53,8.26 8.76,9.02 8.76,11.33 C6.1 | 8.16,11.94 v9.53,11.94
  Bottom 0.406: v9.53,11.94 10.29,12.7 13.84,12.7 15.11,13.97 v15.62,13.97
VDDCORE
  Top 0.254: U$4.43 18.66,9.4 17.78,10.29 C1.1

### Text on the board
tPlace: BAT | En | USB | 13 | 12 | 11 | ~ | 10 | ~ | 9 | ~ | 6 | ~5 | SCL | SDA | #13 | adafruit! | SWD | FLASH | SPI | Reset | Feather M0 | Express | CHG | RST | 3V | ARf | GND | A0 | A1 | A2 | A3 | A4 | A5 | SCK | MO | MI | RX | TX | GND
bPlace: 3.7/4.2V / LiPoly Batt / µUSB charge | En | 13 | 12 | 6 | ~ | 5 | SCL | SDA | BAT | USB | 11~ | 10~ | 9~ | Feather M0 | Express | Developer | ATSAMD21G18 / 48MHz & 3.3V | Edition | SCK | MOSI | MISO | RST | 3V | ARf | GND | A0 | A1 | A2 | A3 | A4 | A5 | RX | TX | GND
214bmp: D:/SmartProjects/Snc/a4_bn_logo2.bmp